# EAGLE design HC-05 (EAGLE 5.11)
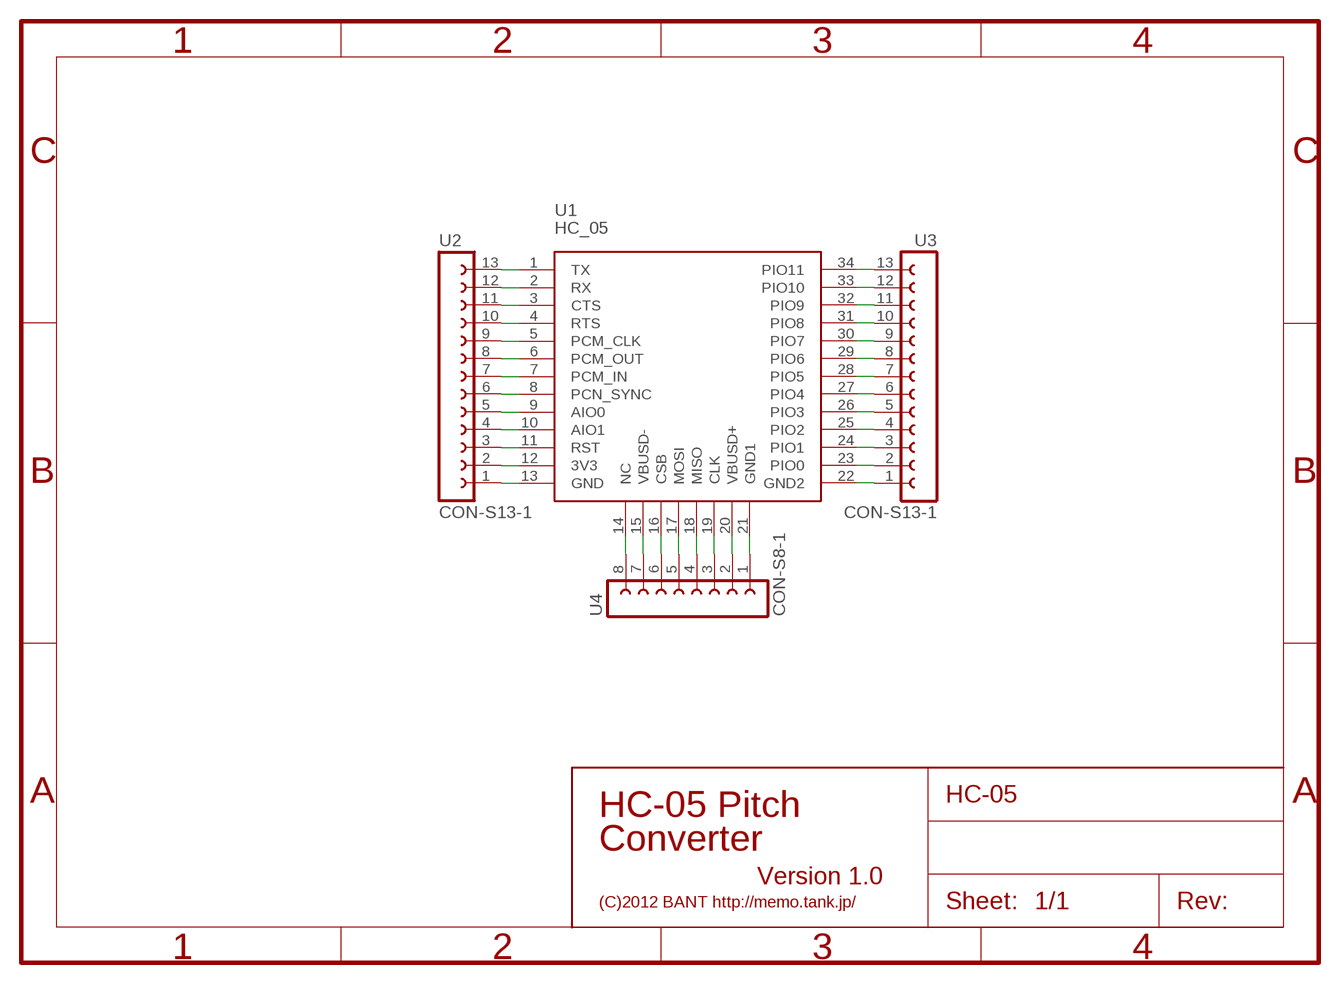
[diagram p0: schematic, sheet 1]

## Parts
U1  HC_05  [BLUETOOTH_SMD]
U2  CON-S13-1  [CON-S13-1]
U3  CON-S13-1  [CON-S13-1]
U4  CON-S8-1  [CON-S8-1]

## Nets
N$1: U1.10(AIO1) U2.4
N$2: U1.9(AIO0) U2.5
N$3: U1.8(PCN_SYNC) U2.6
N$4: U1.7(PCM_IN) U2.7
N$5: U1.6(PCM_OUT) U2.8
N$6: U1.5(PCM_CLK) U2.9
N$7: U1.4(RTS) U2.10
N$8: U1.3(CTS) U2.11
N$9: U1.2(RX) U2.12
N$10: U1.1(TX) U2.13
N$11: U1.11(RST) U2.3
N$12: U1.12(3V3) U2.2
N$13: U1.13(GND) U2.1
N$14: U1.25(PIO2) U3.4
N$15: U1.26(PIO3) U3.5
N$16: U1.27(PIO4) U3.6
N$17: U1.28(PIO5) U3.7
N$18: U1.29(PIO6) U3.8
N$19: U1.30(PIO7) U3.9
N$20: U1.31(PIO8) U3.10
N$21: U1.21(GND1) U4.1
N$22: U1.20(VBUSD+) U4.2
N$23: U1.19(CLK) U4.3
N$24: U1.18(MISO) U4.4
N$25: U1.17(MOSI) U4.5
N$26: U1.16(CSB) U4.6
N$27: U1.15(VBUSD-) U4.7
N$28: U1.14(NC) U4.8
N$29: U1.32(PIO9) U3.11
N$30: U1.33(PIO10) U3.12
N$31: U1.34(PIO11) U3.13
N$32: U1.24(PIO1) U3.3
N$33: U1.23(PIO0) U3.2
N$34: U1.22(GND2) U3.1

## Notes on the sheet
- HC-05 Pitch
- Converter
- Version 1.0
- (C)2012 BANT http://memo.tank.jp/

## Library data of the parts
U1 = SerialPortBluetooth:HC_05
U2 U3 = bant:CON-S13-1
U4 = bant:CON-S8-1

## Board
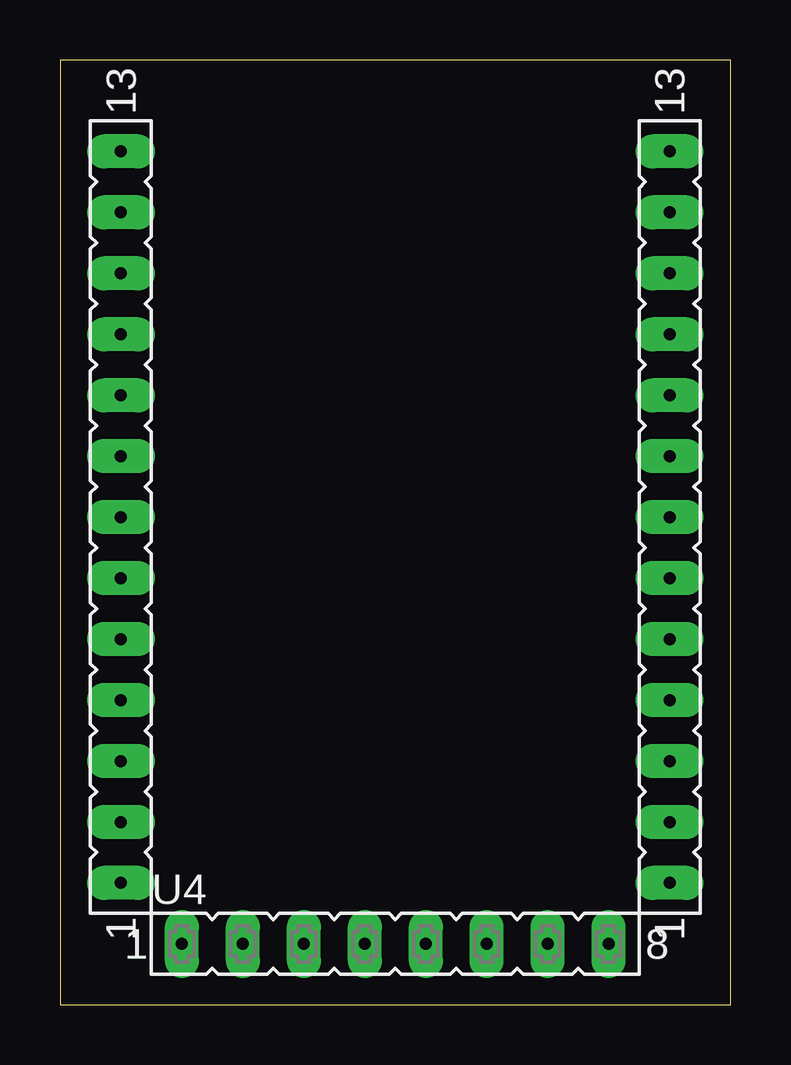
[diagram p1: board, top side]
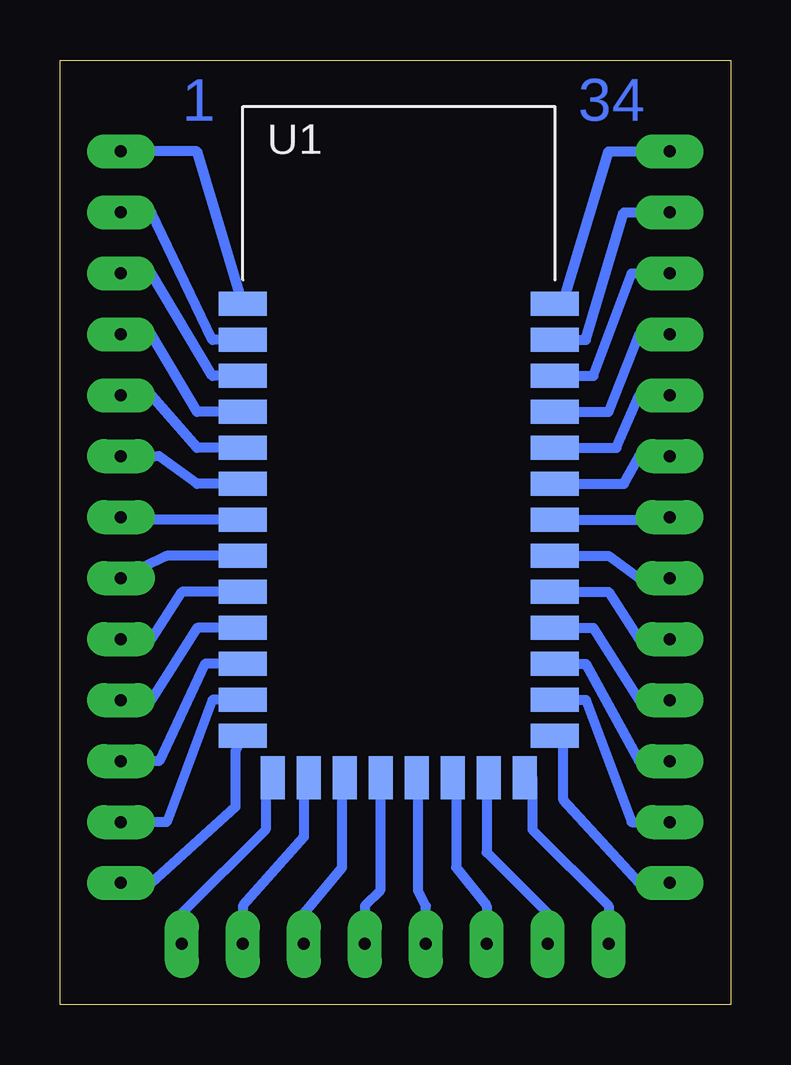
[diagram p2: board, bottom side, seen from below]

Size 27.94 x 39.37 mm. Coordinates in mm from the lower left corner, seen from the top.
Outline: 0,0 27.94,0 27.94,39.37 0,39.37 0,0
Copper layers (1*16): Top 0.035mm / dielectric 1.5mm / Bottom 0.035mm
Design rules "default": minimum track width 10mil, minimum drill 24mil, track to track 8mil, track to pad 8mil, pad to pad 8mil, via to via 8mil, smd to smd 8mil, copper to edge 40mil, drill to drill 8mil, minimum pad ring 10mil, minimum via ring 8mil, stop-mask expansion 4mil, vias tented up to drill 0mil, thermal gap 10mil

### Footprints (pad centres in the part's own frame; a part is rotated, then mirrored left to right if it is on the bottom)
BLUETOOTH_SMD = smd 2 x 1: 1 0,0; 2 0,-1.5; 3 0,-3; 4 0,-4.5; 5 0,-6; 6 0,-7.5; 7 0,-9; 8 0,-10.5; 9 0,-12; 10 0,-13.5; 11 0,-15; 12 0,-16.5; 13 0,-18; 22 13,-18; 23 13,-16.5; 24 13,-15; 25 13,-13.5; 26 13,-12; 27 13,-10.5; 28 13,-9; 29 13,-7.5; 30 13,-6; 31 13,-4.5; 32 13,-3; 33 13,-1.5; 34 13,0 | smd 1 x 1.8: 14 1.25,-19.75; 15 2.75,-19.75; 16 4.25,-19.75; 17 5.75,-19.75; 18 7.25,-19.75; 19 8.75,-19.75; 20 10.25,-19.75; 21 11.75,-19.75
CON-S13-1 = drill 0.5 pad 1.422 long: 1 -15.24,0; 2 -12.7,0; 3 -10.16,0; 4 -7.62,0; 5 -5.08,0; 6 -2.54,0; 7 0,0; 8 2.54,0; 9 5.08,0; 10 7.62,0; 11 10.16,0; 12 12.7,0; 13 15.24,0
CON-S8-1 = drill 0.5 pad 1.422 long: 1 -8.89,0; 2 -6.35,0; 3 -3.81,0; 4 -1.27,0; 5 1.27,0; 6 3.81,0; 7 6.35,0; 8 8.89,0

### Placement (x,y rotation side)
U1  20.32,29.21 0 bottom
U2  25.4,20.32 90 top
U3  2.54,20.32 90 top
U4  13.97,2.54 0 top

### Tracks (layer width: path | path; a pad name or v marks a point on that pad's centre or on a via)
N$1
  Bottom 0.406: U1.10 22.23,15.71 24.13,12.7 U2.4
N$2
  Bottom 0.406: U1.9 22.86,17.21 24.13,15.24 U2.5
N$3
  Bottom 0.406: U1.8 23.5,18.71 U2.6
N$4
  Bottom 0.406: U1.7 24.13,20.21 U2.7
N$5
  Bottom 0.406: U1.6 22.23,21.71 23.81,22.86 25.4,22.66 U2.8
N$6
  Bottom 0.406: U1.5 22.23,23.21 24.13,25.4 U2.9
N$7
  Bottom 0.406: U1.4 22.23,24.71 24.13,27.94 U2.10
N$8
  Bottom 0.406: U1.3 21.59,26.21 24.13,30.48 U2.11
N$9
  Bottom 0.406: U1.2 21.59,27.71 24.13,33.02 U2.12
N$10
  Bottom 0.406: U1.1 22.23,35.56 U2.13
N$11
  Bottom 0.406: U1.11 21.91,14.21 23.81,10.16 U2.3
N$12
  Bottom 0.406: U1.12 21.59,12.71 23.5,7.62 U2.2
N$13
  Bottom 0.406: U1.13 20.64,10.57 20.64,8.26 24.13,5.08 U2.1
N$14
  Bottom 0.406: U1.25 5.71,15.71 3.81,12.7 U3.4
N$15
  Bottom 0.406: U1.26 5.08,17.21 3.81,15.24 U3.5
N$16
  Bottom 0.406: U1.27 5.08,18.71 3.81,17.78 U3.6
N$17
  Bottom 0.406: U1.28 2.54,20.21 U3.7
N$18
  Bottom 0.406: U1.29 4.45,21.71 3.81,22.86 U3.8
N$19
  Bottom 0.406: U1.30 4.76,23.21 3.81,25.4 U3.9
N$20
  Bottom 0.406: U1.31 5.08,24.71 3.81,27.94 U3.10
N$21
  Bottom 0.406: U1.21 8.26,9.46 8.26,7.3 5.08,4.13 U4.1
N$22
  Bottom 0.406: U1.20 10.16,9.46 10.16,6.35 7.62,3.81 U4.2
N$23
  Bottom 0.406: U1.19 11.43,9.46 11.43,5.71 10.16,4.13 U4.3
N$24
  Bottom 0.406: U1.18 13.02,9.46 13.02,4.76 12.7,4.13 U4.4
N$25
  Bottom 0.406: U1.17 14.61,9.46 14.61,4.76 15.24,4.13 U4.5
N$26
  Bottom 0.406: U1.16 16.19,9.46 16.19,5.71 17.78,3.81 U4.6
N$27
  Bottom 0.406: U1.15 17.78,9.46 17.78,6.99 20.32,4.13 U4.7
N$28
  Bottom 0.406: U1.14 19.37,9.46 19.37,7.3 22.86,3.81 U4.8
N$29
  Bottom 0.406: U1.32 5.71,26.21 4.13,30.48 U3.11
N$30
  Bottom 0.406: U1.33 6.03,27.71 4.45,33.02 U3.12
N$31
  Bottom 0.406: U1.34 6.99,29.21 5.08,35.56 U3.13
N$32
  Bottom 0.406: U1.24 6.03,14.21 3.81,10.16 U3.3
N$33
  Bottom 0.406: U1.23 6.03,12.71 4.13,7.62 U3.2
N$34
  Bottom 0.406: U1.22 6.99,11.21 6.99,8.57 3.81,5.08 U3.1

### Text on the board
Bottom: 34 | 1